# Altium schematic sheet Pioneer.SchDoc
size 299 x 199 mm
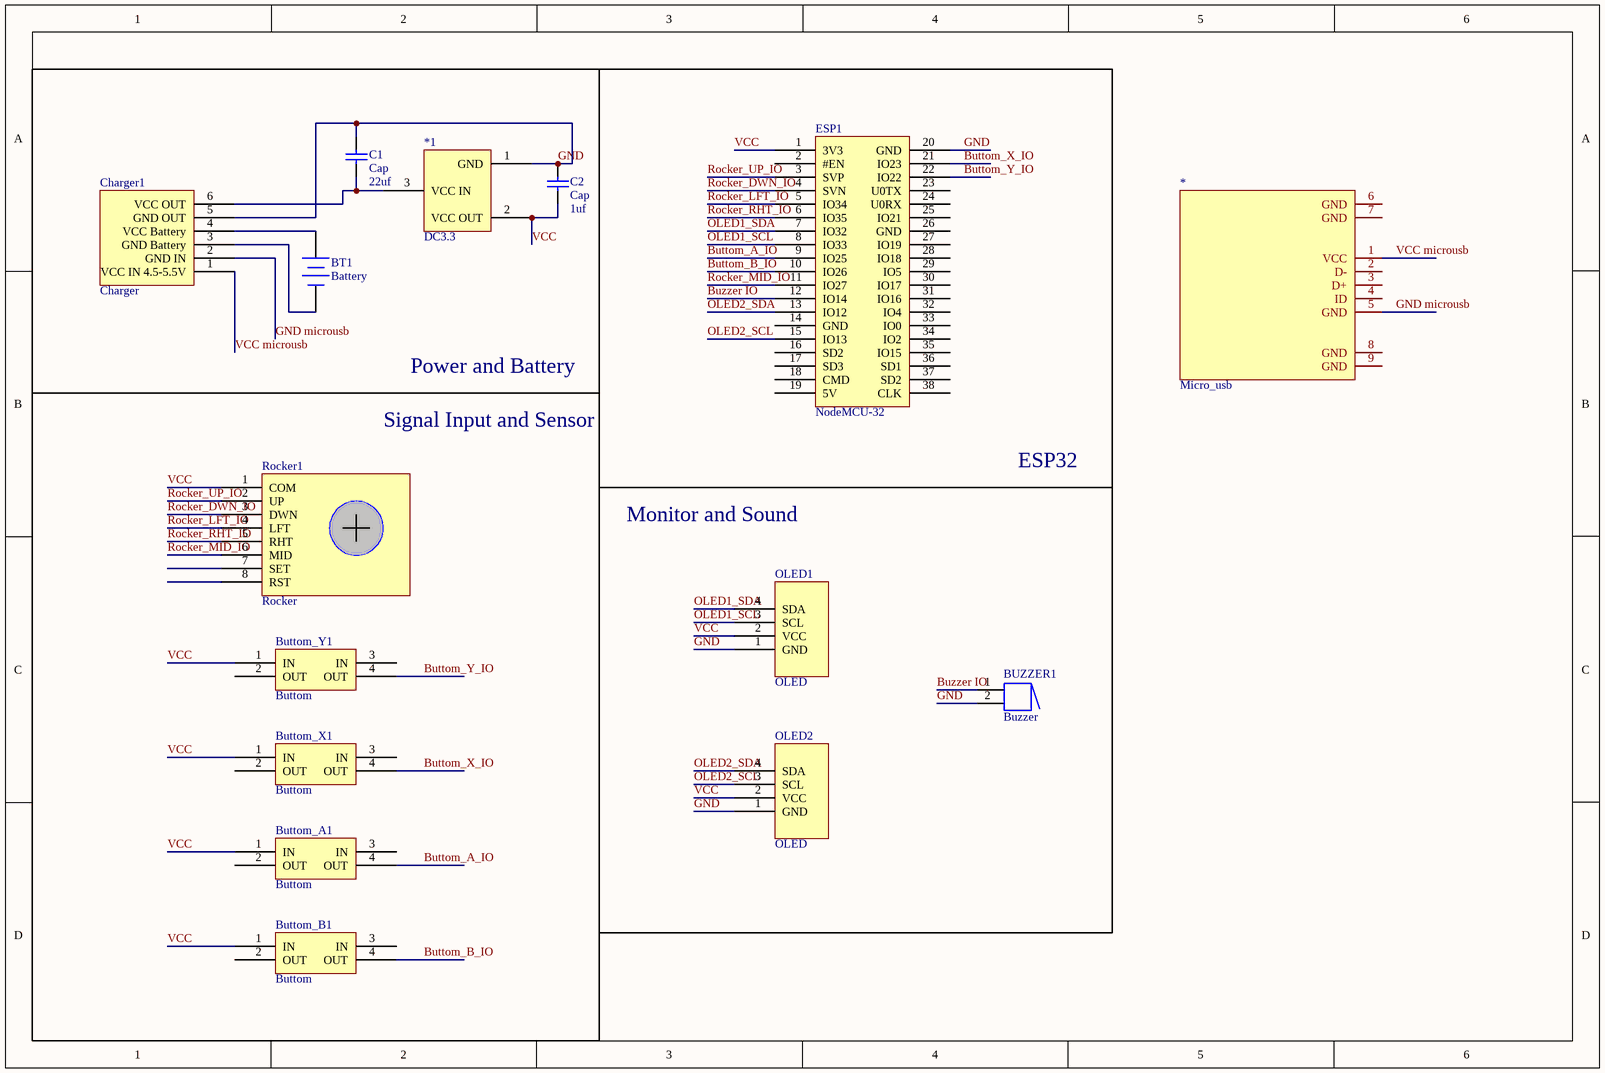
[diagram p0: Pioneer.SchDoc]

## Parts
*  Micro_usb  [Micro_usb]
*1  DC3.3  [SOT23_M]
BT1  Battery  [BAT-2]
Buttom_A1  Buttom  [Buttom]
Buttom_B1  Buttom  [Buttom]
Buttom_X1  Buttom  [Buttom]
Buttom_Y1  Buttom  [Buttom]
BUZZER1  Buzzer  [Buzzer]
C1  Cap  value 22uf  [0603]
C2  Cap  value 1uf  [0603]
Charger1  Charger  [charge]
ESP1  NodeMCU-32  [NodeMCU-32]
OLED1  OLED  [OLED]
OLED2  OLED  [OLED]
Rocker1  Rocker  [rocker]

## Nets
Buttom_A_IO: Buttom_A1.4(OUT) ESP1.9(IO25)
Buttom_B_IO: Buttom_B1.4(OUT) ESP1.10(IO26)
Buttom_X_IO: Buttom_X1.4(OUT) ESP1.21(IO23)
Buttom_Y_IO: Buttom_Y1.4(OUT) ESP1.22(IO22)
Buzzer IO: BUZZER1.1 ESP1.12(IO14)
GND: *1.1(GND) BUZZER1.2 C1.2 C2.2 Charger1.5(GND_OUT) ESP1.20(GND) OLED1.1(GND) OLED2.1(GND)
GND microusb: *.5(GND) Charger1.2(GND_IN)
OLED1_SCL: ESP1.8(IO33) OLED1.3(SCL)
OLED1_SDA: ESP1.7(IO32) OLED1.4(SDA)
OLED2_SCL: ESP1.15(IO13) OLED2.3(SCL)
OLED2_SDA: ESP1.13(IO12) OLED2.4(SDA)
Rocker_DWN_IO: ESP1.4(SVN) Rocker1.3(DWN)
Rocker_LFT_IO: ESP1.5(IO34) Rocker1.4(LFT)
Rocker_MID_IO: ESP1.11(IO27) Rocker1.6(MID)
Rocker_RHT_IO: ESP1.6(IO35) Rocker1.5(RHT)
Rocker_UP_IO: ESP1.3(SVP) Rocker1.2(UP)
VCC: *1.2(VCC_OUT) Buttom_A1.1(IN) Buttom_B1.1(IN) Buttom_X1.1(IN) Buttom_Y1.1(IN) C2.1 ESP1.1(3V3) OLED1.2(VCC) OLED2.2(VCC) Rocker1.1(COM)
VCC microusb: *.1(VCC) Charger1.1(VCC_IN_4.5-5.5V)
Net*1_3: *1.3(VCC_IN) C1.1 Charger1.6(VCC_OUT)
NetBT1_1: BT1.1(+) Charger1.4(VCC_Battery)
NetBT1_2: BT1.2(-) Charger1.3(GND_Battery)

Not connected (* = marked no-connect by the designer): * 2(D-) 3(D+) 4(ID) 6(GND) 7(GND) 8(GND) 9(GND); Buttom_A1 2(OUT) 3(IN); Buttom_B1 2(OUT) 3(IN); Buttom_X1 2(OUT) 3(IN); Buttom_Y1 2(OUT) 3(IN); ESP1 2(#EN) 14(GND) 16(SD2) 17(SD3) 18(CMD) 19(5V) 23(U0TX) 24(U0RX) 25(IO21) 26(GND) 27(IO19) 28(IO18) 29(IO5) 30(IO17) 31(IO16) 32(IO4) 33(IO0) 34(IO2) 35(IO15) 36(SD1) 37(SD2) 38(CLK); Rocker1 7(SET) 8(RST)

## Notes on the sheet
- Power and Battery
- Signal Input and Sensor
- ESP32
- Monitor and Sound

## Library data of the parts
BT1 = Battery: Multicell Battery; Published: 24-Mar-1999; LatestRevisionDate: 17-Jul-2002; LatestRevisionNote: Re-released for DXP Platform.; PackageReference: BAT-2; Publisher: Altium Limited; PackageDescription: Battery; 2 Leads
BUZZER1 = Buzzer: Magnetic Transducer Buzzer; Published: 24-Mar-1999; LatestRevisionDate: 17-Dec-2003; LatestRevisionNote: Schematic revised, PCB Footprint replaced.; DatasheetVersion: 17-Dec-2003; PackageReference: ABSM-1574; Publisher: Altium Limited; PackageDescription: Magnetic Transducer Buzzer; ComponentLink1Description: Manufacturer Link; ComponentLink1URL: http://www.megastar.com/linecard/buzzmode/index.php
C1 C2 = Cap: Capacitor; Published: 8-Jun-2000; LatestRevisionDate: 17-Jul-2002; LatestRevisionNote: Re-released for DXP Platform.; PackageReference: RAD-0.3; Publisher: Altium Limited; PackageDescription: Radial Cap, Thru-Hole; 2 Leads; 0.3 in Pin Spacing